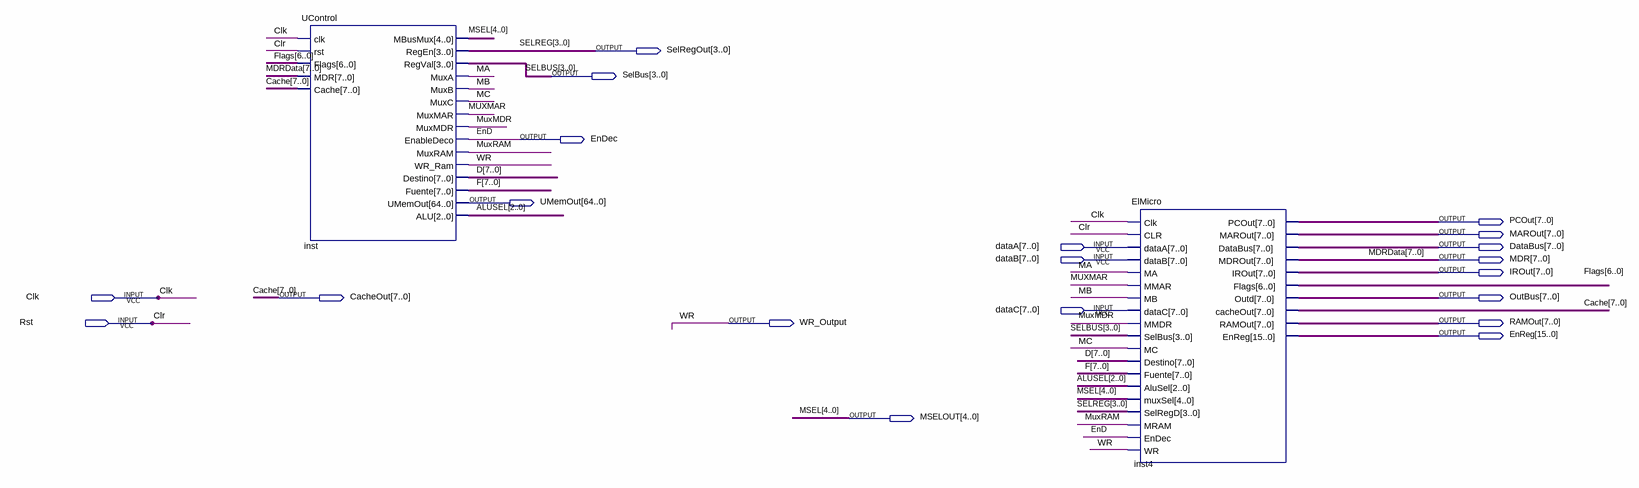
[diagram p0: schematic sheet]
// Quartus schematic MiQro_EVA.bdf as structural Verilog: 2 symbols, 20 pins
module MiQro_EVA (
  input  [7:0] dataA,
  input  [7:0] dataB,
  input  Clk,
  input  [7:0] dataC,
  input  Rst,
  output [3:0] SelRegOut,
  output [3:0] SelBus,
  output EnDec,
  output [64:0] UMemOut,
  output [7:0] PCOut,
  output [7:0] MAROut,
  output [7:0] DataBus,
  output [7:0] MDR,
  output [7:0] IROut,
  output [7:0] CacheOut,
  output [7:0] OutBus,
  output WR_Output,
  output [7:0] RAMOut,
  output [15:0] EnReg,
  output [4:0] MSELOUT
);

  wire MA, MB, MC, MUXMAR, MuxMDR, MuxRAM;
  wire [2:0] ALUSEL;
  wire [6:0] Flags;
  wire [7:0] D, F;

  UControl inst (
    .clk(Clk), .rst(Rst), .Flags(Flags), .MDR(MDR), .Cache(CacheOut), .MBusMux(MSELOUT), .RegEn(SelRegOut),
    .RegVal(SelBus), .MuxA(MA), .MuxB(MB), .MuxC(MC), .MuxMAR(MUXMAR), .MuxMDR(MuxMDR), .EnableDeco(EnDec),
    .MuxRAM(MuxRAM), .WR_Ram(WR_Output), .Destino(D), .Fuente(F), .UMemOut(UMemOut), .ALU(ALUSEL));
  ElMicro inst4 (
    .Clk(Clk), .CLR(Rst), .dataA(dataA), .dataB(dataB), .MA(MA), .MMAR(MUXMAR), .MB(MB), .dataC(dataC),
    .MMDR(MuxMDR), .SelBus(SelBus), .MC(MC), .Destino(D), .Fuente(F), .AluSel(ALUSEL), .muxSel(MSELOUT),
    .SelRegD(SelRegOut), .MRAM(MuxRAM), .EnDec(EnDec), .WR(WR_Output), .PCOut(PCOut), .MAROut(MAROut),
    .DataBus(DataBus), .MDROut(MDR), .IROut(IROut), .Flags(Flags), .Outd(OutBus), .cacheOut(CacheOut),
    .RAMOut(RAMOut), .EnReg(EnReg));

  // Other names for the same wires on the sheet: Cache[7:0] = CacheOut; EnD = EnDec; MDRData[7:0] = MDR;
  //   MSEL[4:0] = MSELOUT; Clr = Rst; SELREG[3:0] = SelRegOut; WR = WR_Output
endmodule
